# EAGLE design ledboard (EAGLE 6.5.0)
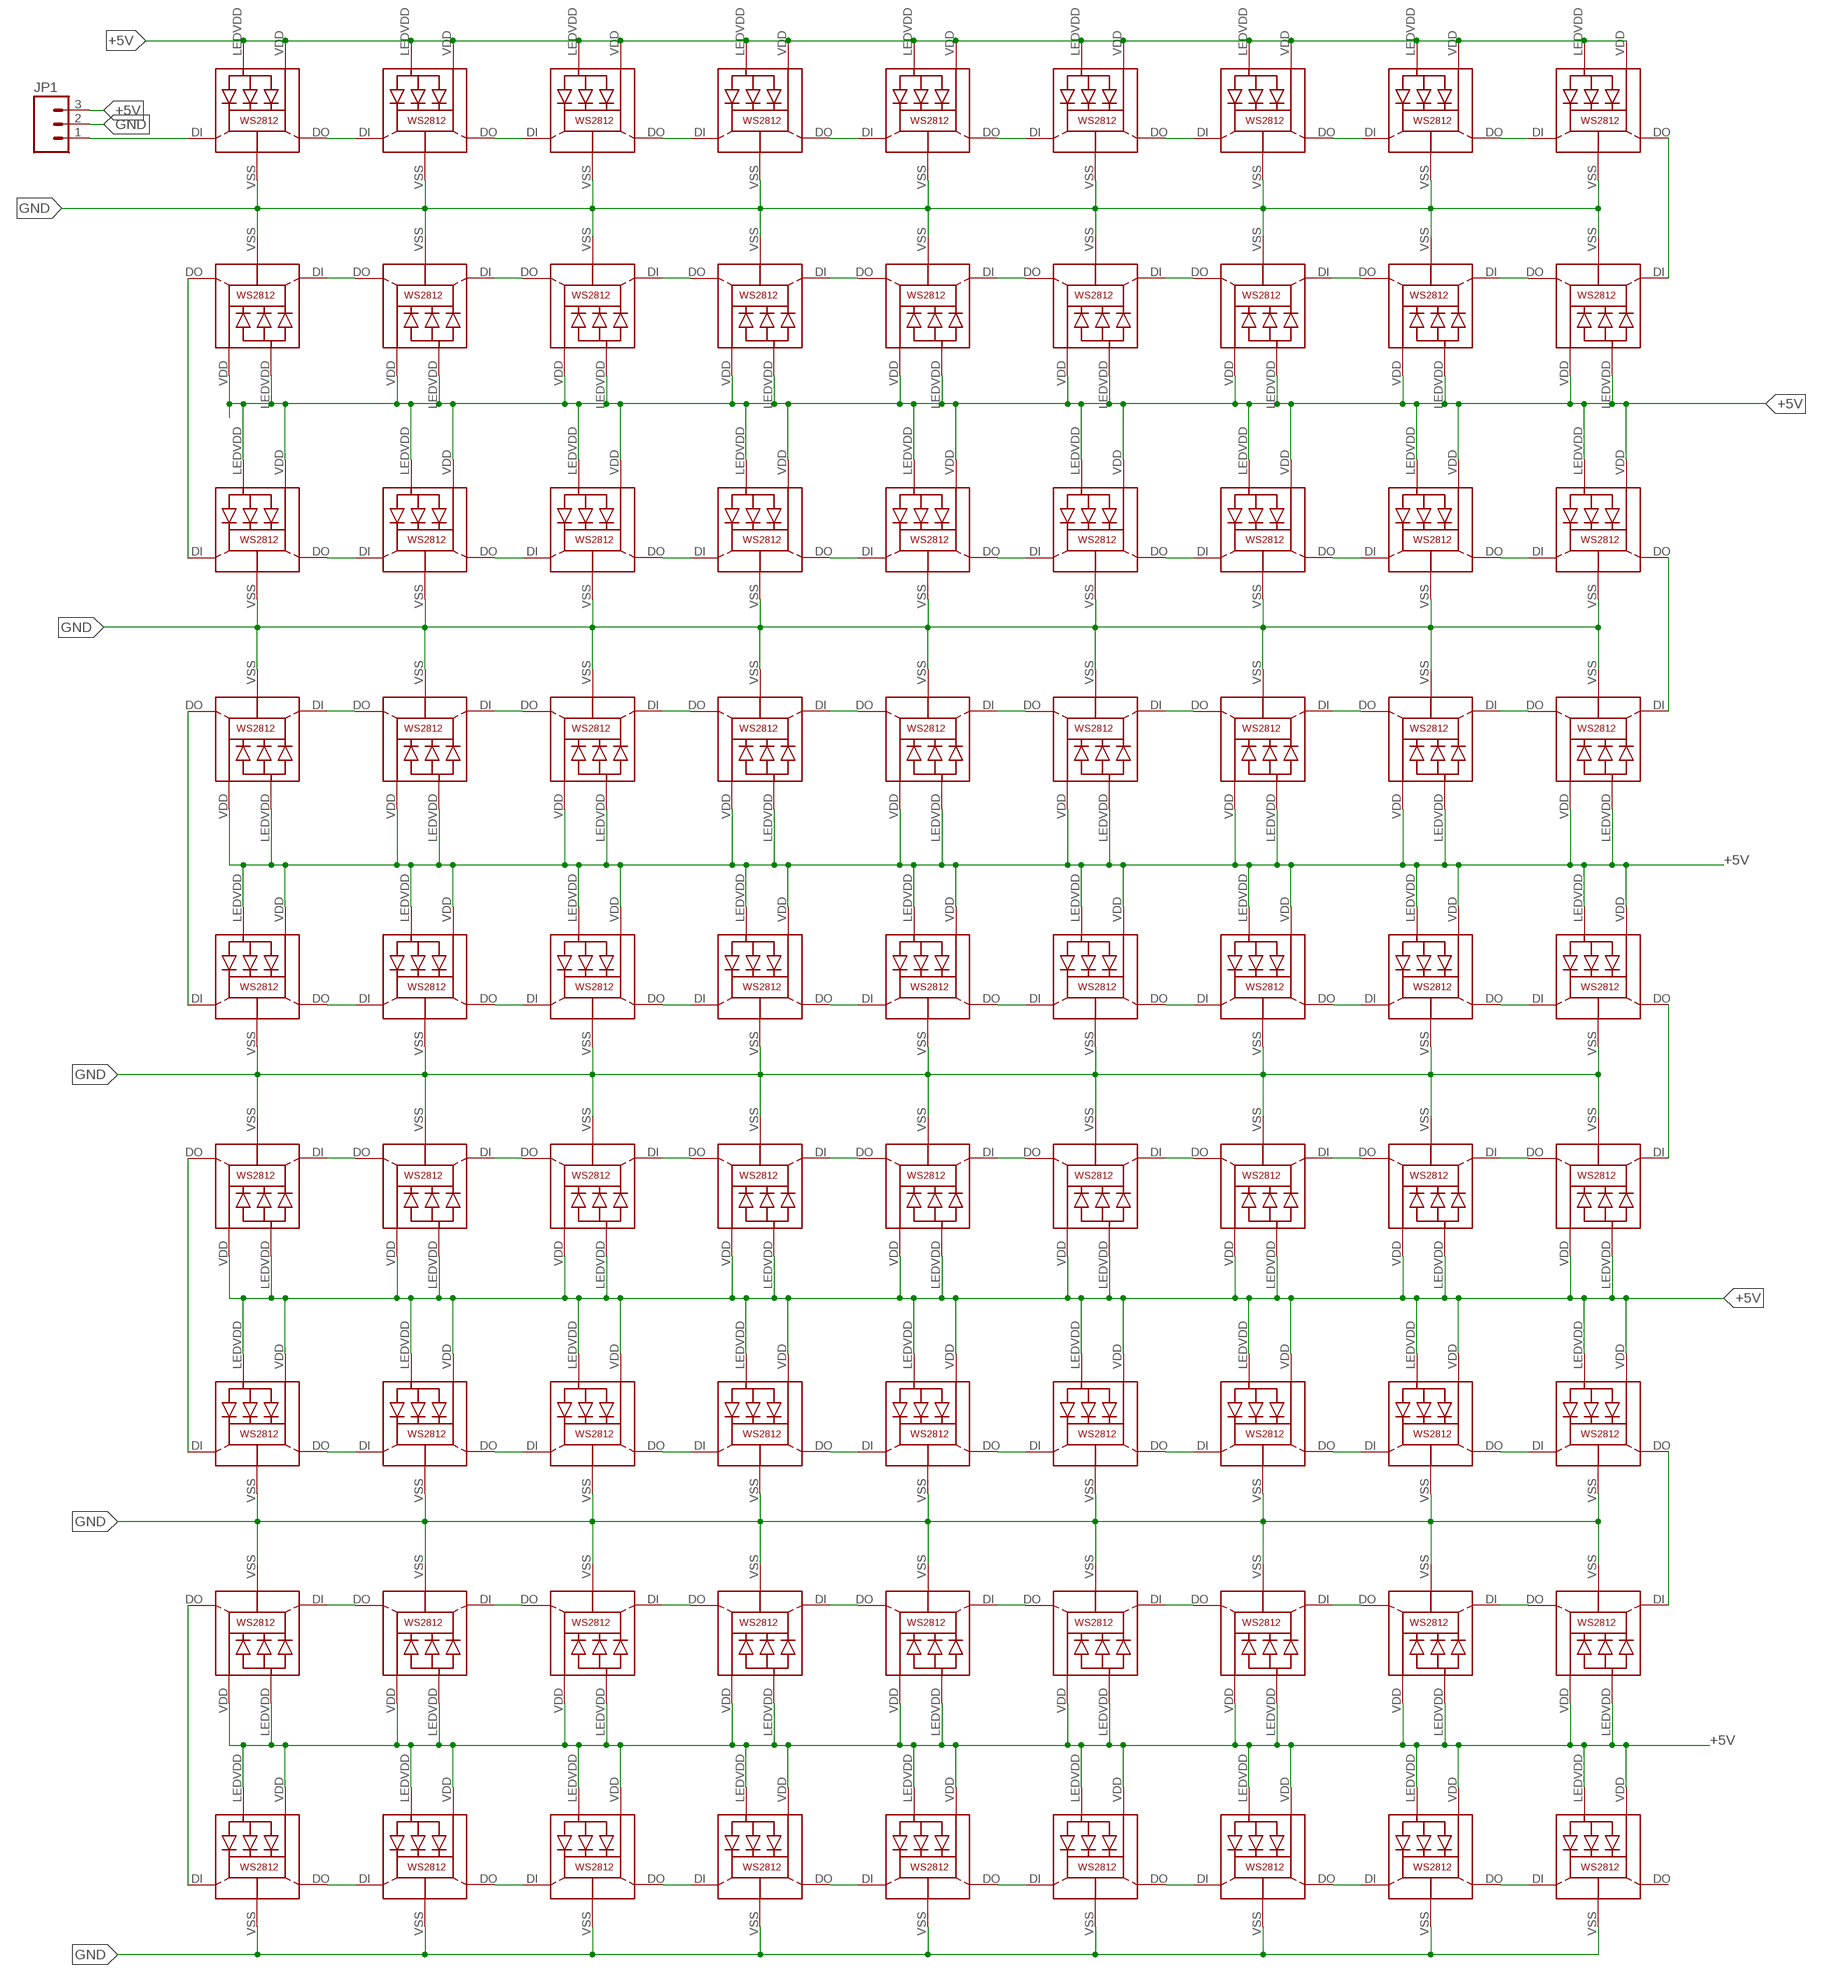
[diagram p0: schematic, sheet 1]

## Parts
JP1  M03LONGPADS  [1X03_LONGPADS]
LEDG00  WS2812  [WS2812]
LEDG01  WS2812  [WS2812]
LEDG02  WS2812  [WS2812]
LEDG03  WS2812  [WS2812]
LEDG04  WS2812  [WS2812]
LEDG05  WS2812  [WS2812]
LEDG06  WS2812  [WS2812]
LEDG07  WS2812  [WS2812]
LEDG08  WS2812  [WS2812]
LEDG10  WS2812  [WS2812]
LEDG11  WS2812  [WS2812]
LEDG12  WS2812  [WS2812]
LEDG13  WS2812  [WS2812]
LEDG14  WS2812  [WS2812]
LEDG15  WS2812  [WS2812]
LEDG16  WS2812  [WS2812]
LEDG17  WS2812  [WS2812]
LEDG18  WS2812  [WS2812]
LEDG20  WS2812  [WS2812]
LEDG21  WS2812  [WS2812]
LEDG22  WS2812  [WS2812]
LEDG23  WS2812  [WS2812]
LEDG24  WS2812  [WS2812]
LEDG25  WS2812  [WS2812]
LEDG26  WS2812  [WS2812]
LEDG27  WS2812  [WS2812]
LEDG28  WS2812  [WS2812]
LEDG30  WS2812  [WS2812]
LEDG31  WS2812  [WS2812]
LEDG32  WS2812  [WS2812]
LEDG33  WS2812  [WS2812]
LEDG34  WS2812  [WS2812]
LEDG35  WS2812  [WS2812]
LEDG36  WS2812  [WS2812]
LEDG37  WS2812  [WS2812]
LEDG38  WS2812  [WS2812]
LEDG40  WS2812  [WS2812]
LEDG41  WS2812  [WS2812]
LEDG42  WS2812  [WS2812]
LEDG43  WS2812  [WS2812]
LEDG44  WS2812  [WS2812]
LEDG45  WS2812  [WS2812]
LEDG46  WS2812  [WS2812]
LEDG47  WS2812  [WS2812]
LEDG48  WS2812  [WS2812]
LEDG50  WS2812  [WS2812]
LEDG51  WS2812  [WS2812]
LEDG52  WS2812  [WS2812]
LEDG53  WS2812  [WS2812]
LEDG54  WS2812  [WS2812]
LEDG55  WS2812  [WS2812]
LEDG56  WS2812  [WS2812]
LEDG57  WS2812  [WS2812]
LEDG58  WS2812  [WS2812]
LEDG60  WS2812  [WS2812]
LEDG61  WS2812  [WS2812]
LEDG62  WS2812  [WS2812]
LEDG63  WS2812  [WS2812]
LEDG64  WS2812  [WS2812]
LEDG65  WS2812  [WS2812]
LEDG66  WS2812  [WS2812]
LEDG67  WS2812  [WS2812]
LEDG68  WS2812  [WS2812]
LEDG70  WS2812  [WS2812]
LEDG71  WS2812  [WS2812]
LEDG72  WS2812  [WS2812]
LEDG73  WS2812  [WS2812]
LEDG74  WS2812  [WS2812]
LEDG75  WS2812  [WS2812]
LEDG76  WS2812  [WS2812]
LEDG77  WS2812  [WS2812]
LEDG78  WS2812  [WS2812]
LEDG80  WS2812  [WS2812]
LEDG81  WS2812  [WS2812]
LEDG82  WS2812  [WS2812]
LEDG83  WS2812  [WS2812]
LEDG84  WS2812  [WS2812]
LEDG85  WS2812  [WS2812]
LEDG86  WS2812  [WS2812]
LEDG87  WS2812  [WS2812]
LEDG88  WS2812  [WS2812]

## Nets
+5V: JP1.3 LEDG00.LEDVDD LEDG00.VDD LEDG01.LEDVDD LEDG01.VDD LEDG02.LEDVDD LEDG02.VDD LEDG03.LEDVDD LEDG03.VDD LEDG04.LEDVDD LEDG04.VDD LEDG05.LEDVDD LEDG05.VDD LEDG06.LEDVDD LEDG06.VDD LEDG07.LEDVDD LEDG07.VDD LEDG08.LEDVDD LEDG08.VDD LEDG10.LEDVDD LEDG10.VDD LEDG11.LEDVDD LEDG11.VDD LEDG12.LEDVDD LEDG12.VDD LEDG13.LEDVDD LEDG13.VDD LEDG14.LEDVDD LEDG14.VDD LEDG15.LEDVDD LEDG15.VDD LEDG16.LEDVDD LEDG16.VDD LEDG17.LEDVDD LEDG17.VDD LEDG18.LEDVDD LEDG18.VDD LEDG20.LEDVDD LEDG20.VDD LEDG21.LEDVDD LEDG21.VDD LEDG22.LEDVDD LEDG22.VDD LEDG23.LEDVDD LEDG23.VDD LEDG24.LEDVDD LEDG24.VDD LEDG25.LEDVDD LEDG25.VDD LEDG26.LEDVDD LEDG26.VDD LEDG27.LEDVDD LEDG27.VDD LEDG28.LEDVDD LEDG28.VDD LEDG30.LEDVDD LEDG30.VDD LEDG31.LEDVDD LEDG31.VDD LEDG32.LEDVDD LEDG32.VDD LEDG33.LEDVDD LEDG33.VDD LEDG34.LEDVDD LEDG34.VDD LEDG35.LEDVDD LEDG35.VDD LEDG36.LEDVDD LEDG36.VDD LEDG37.LEDVDD LEDG37.VDD LEDG38.LEDVDD LEDG38.VDD LEDG40.LEDVDD LEDG40.VDD LEDG41.LEDVDD LEDG41.VDD LEDG42.LEDVDD LEDG42.VDD LEDG43.LEDVDD LEDG43.VDD LEDG44.LEDVDD LEDG44.VDD LEDG45.LEDVDD LEDG45.VDD LEDG46.LEDVDD LEDG46.VDD LEDG47.LEDVDD LEDG47.VDD LEDG48.LEDVDD LEDG48.VDD LEDG50.LEDVDD LEDG50.VDD LEDG51.LEDVDD LEDG51.VDD LEDG52.LEDVDD LEDG52.VDD LEDG53.LEDVDD LEDG53.VDD LEDG54.LEDVDD LEDG54.VDD LEDG55.LEDVDD LEDG55.VDD LEDG56.LEDVDD LEDG56.VDD LEDG57.LEDVDD LEDG57.VDD LEDG58.LEDVDD LEDG58.VDD LEDG60.LEDVDD LEDG60.VDD LEDG61.LEDVDD LEDG61.VDD LEDG62.LEDVDD LEDG62.VDD LEDG63.LEDVDD LEDG63.VDD LEDG64.LEDVDD LEDG64.VDD LEDG65.LEDVDD LEDG65.VDD LEDG66.LEDVDD LEDG66.VDD LEDG67.LEDVDD LEDG67.VDD LEDG68.LEDVDD LEDG68.VDD LEDG70.LEDVDD LEDG70.VDD LEDG71.LEDVDD LEDG71.VDD LEDG72.LEDVDD LEDG72.VDD LEDG73.LEDVDD LEDG73.VDD LEDG74.LEDVDD LEDG74.VDD LEDG75.LEDVDD LEDG75.VDD LEDG76.LEDVDD LEDG76.VDD LEDG77.LEDVDD LEDG77.VDD LEDG78.LEDVDD LEDG78.VDD LEDG80.LEDVDD LEDG80.VDD LEDG81.LEDVDD LEDG81.VDD LEDG82.LEDVDD LEDG82.VDD LEDG83.LEDVDD LEDG83.VDD LEDG84.LEDVDD LEDG84.VDD LEDG85.LEDVDD LEDG85.VDD LEDG86.LEDVDD LEDG86.VDD LEDG87.LEDVDD LEDG87.VDD LEDG88.LEDVDD LEDG88.VDD
DIN: JP1.1 LEDG00.DI
GND: JP1.2 LEDG00.VSS(GND) LEDG01.VSS(GND) LEDG02.VSS(GND) LEDG03.VSS(GND) LEDG04.VSS(GND) LEDG05.VSS(GND) LEDG06.VSS(GND) LEDG07.VSS(GND) LEDG08.VSS(GND) LEDG10.VSS(GND) LEDG11.VSS(GND) LEDG12.VSS(GND) LEDG13.VSS(GND) LEDG14.VSS(GND) LEDG15.VSS(GND) LEDG16.VSS(GND) LEDG17.VSS(GND) LEDG18.VSS(GND) LEDG20.VSS(GND) LEDG21.VSS(GND) LEDG22.VSS(GND) LEDG23.VSS(GND) LEDG24.VSS(GND) LEDG25.VSS(GND) LEDG26.VSS(GND) LEDG27.VSS(GND) LEDG28.VSS(GND) LEDG30.VSS(GND) LEDG31.VSS(GND) LEDG32.VSS(GND) LEDG33.VSS(GND) LEDG34.VSS(GND) LEDG35.VSS(GND) LEDG36.VSS(GND) LEDG37.VSS(GND) LEDG38.VSS(GND) LEDG40.VSS(GND) LEDG41.VSS(GND) LEDG42.VSS(GND) LEDG43.VSS(GND) LEDG44.VSS(GND) LEDG45.VSS(GND) LEDG46.VSS(GND) LEDG47.VSS(GND) LEDG48.VSS(GND) LEDG50.VSS(GND) LEDG51.VSS(GND) LEDG52.VSS(GND) LEDG53.VSS(GND) LEDG54.VSS(GND) LEDG55.VSS(GND) LEDG56.VSS(GND) LEDG57.VSS(GND) LEDG58.VSS(GND) LEDG60.VSS(GND) LEDG61.VSS(GND) LEDG62.VSS(GND) LEDG63.VSS(GND) LEDG64.VSS(GND) LEDG65.VSS(GND) LEDG66.VSS(GND) LEDG67.VSS(GND) LEDG68.VSS(GND) LEDG70.VSS(GND) LEDG71.VSS(GND) LEDG72.VSS(GND) LEDG73.VSS(GND) LEDG74.VSS(GND) LEDG75.VSS(GND) LEDG76.VSS(GND) LEDG77.VSS(GND) LEDG78.VSS(GND) LEDG80.VSS(GND) LEDG81.VSS(GND) LEDG82.VSS(GND) LEDG83.VSS(GND) LEDG84.VSS(GND) LEDG85.VSS(GND) LEDG86.VSS(GND) LEDG87.VSS(GND) LEDG88.VSS(GND)
N$2: LEDG00.DO LEDG10.DI
N$3: LEDG10.DO LEDG20.DI
N$4: LEDG20.DO LEDG30.DI
N$5: LEDG30.DO LEDG40.DI
N$6: LEDG40.DO LEDG50.DI
N$7: LEDG50.DO LEDG60.DI
N$8: LEDG60.DO LEDG70.DI
N$9: LEDG70.DO LEDG80.DI
N$10: LEDG80.DO LEDG81.DI
N$11: LEDG71.DI LEDG81.DO
N$12: LEDG61.DI LEDG71.DO
N$13: LEDG51.DI LEDG61.DO
N$14: LEDG41.DI LEDG51.DO
N$15: LEDG31.DI LEDG41.DO
N$16: LEDG21.DI LEDG31.DO
N$17: LEDG11.DI LEDG21.DO
N$18: LEDG01.DI LEDG11.DO
N$19: LEDG01.DO LEDG02.DI
N$20: LEDG02.DO LEDG12.DI
N$21: LEDG12.DO LEDG22.DI
N$22: LEDG22.DO LEDG32.DI
N$23: LEDG32.DO LEDG42.DI
N$24: LEDG42.DO LEDG52.DI
N$25: LEDG52.DO LEDG62.DI
N$26: LEDG62.DO LEDG72.DI
N$27: LEDG72.DO LEDG82.DI
N$28: LEDG82.DO LEDG83.DI
N$29: LEDG73.DI LEDG83.DO
N$30: LEDG63.DI LEDG73.DO
N$31: LEDG53.DI LEDG63.DO
N$32: LEDG43.DI LEDG53.DO
N$33: LEDG33.DI LEDG43.DO
N$34: LEDG23.DI LEDG33.DO
N$35: LEDG13.DI LEDG23.DO
N$36: LEDG03.DI LEDG13.DO
N$37: LEDG03.DO LEDG04.DI
N$38: LEDG04.DO LEDG14.DI
N$39: LEDG14.DO LEDG24.DI
N$40: LEDG24.DO LEDG34.DI
N$41: LEDG34.DO LEDG44.DI
N$42: LEDG44.DO LEDG54.DI
N$43: LEDG54.DO LEDG64.DI
N$44: LEDG64.DO LEDG74.DI
N$45: LEDG74.DO LEDG84.DI
N$46: LEDG84.DO LEDG85.DI
N$47: LEDG75.DI LEDG85.DO
N$48: LEDG65.DI LEDG75.DO
N$49: LEDG55.DI LEDG65.DO
N$50: LEDG45.DI LEDG55.DO
N$51: LEDG35.DI LEDG45.DO
N$52: LEDG25.DI LEDG35.DO
N$53: LEDG15.DI LEDG25.DO
N$54: LEDG05.DI LEDG15.DO
N$55: LEDG05.DO LEDG06.DI
N$56: LEDG06.DO LEDG16.DI
N$57: LEDG16.DO LEDG26.DI
N$58: LEDG26.DO LEDG36.DI
N$59: LEDG36.DO LEDG46.DI
N$60: LEDG46.DO LEDG56.DI
N$61: LEDG56.DO LEDG66.DI
N$62: LEDG66.DO LEDG76.DI
N$63: LEDG76.DO LEDG86.DI
N$64: LEDG86.DO LEDG87.DI
N$65: LEDG77.DI LEDG87.DO
N$66: LEDG67.DI LEDG77.DO
N$67: LEDG57.DI LEDG67.DO
N$68: LEDG47.DI LEDG57.DO
N$69: LEDG37.DI LEDG47.DO
N$70: LEDG27.DI LEDG37.DO
N$71: LEDG17.DI LEDG27.DO
N$72: LEDG07.DI LEDG17.DO
N$73: LEDG07.DO LEDG08.DI
N$74: LEDG08.DO LEDG18.DI
N$75: LEDG18.DO LEDG28.DI
N$76: LEDG28.DO LEDG38.DI
N$77: LEDG38.DO LEDG48.DI
N$78: LEDG48.DO LEDG58.DI
N$79: LEDG58.DO LEDG68.DI
N$80: LEDG68.DO LEDG78.DI
N$81: LEDG78.DO LEDG88.DI
Unconnected: LEDG88.DO

## Library data of the parts
JP1 = SparkFun-Connectors:M03: Header 3 Standard 3-pin 0.1" header. Use with straight break away headers (SKU : PRT-00116), right angle break away headers (PRT-00553), swiss pins (PRT-00743), machine pins (PRT-00117), and female headers (PRT-00115). Molex polarized connector foot print use with SKU : PRT-08232 with associated crimp pins and housings.
LEDG00 LEDG01-LEDG08 LEDG10-LEDG18 LEDG20-LEDG28 LEDG30-LEDG38 LEDG40-LEDG48 LEDG50-LEDG58 LEDG60-LEDG68 LEDG70-LEDG78 LEDG80-LEDG88 = adafruit:WS2812

## Board
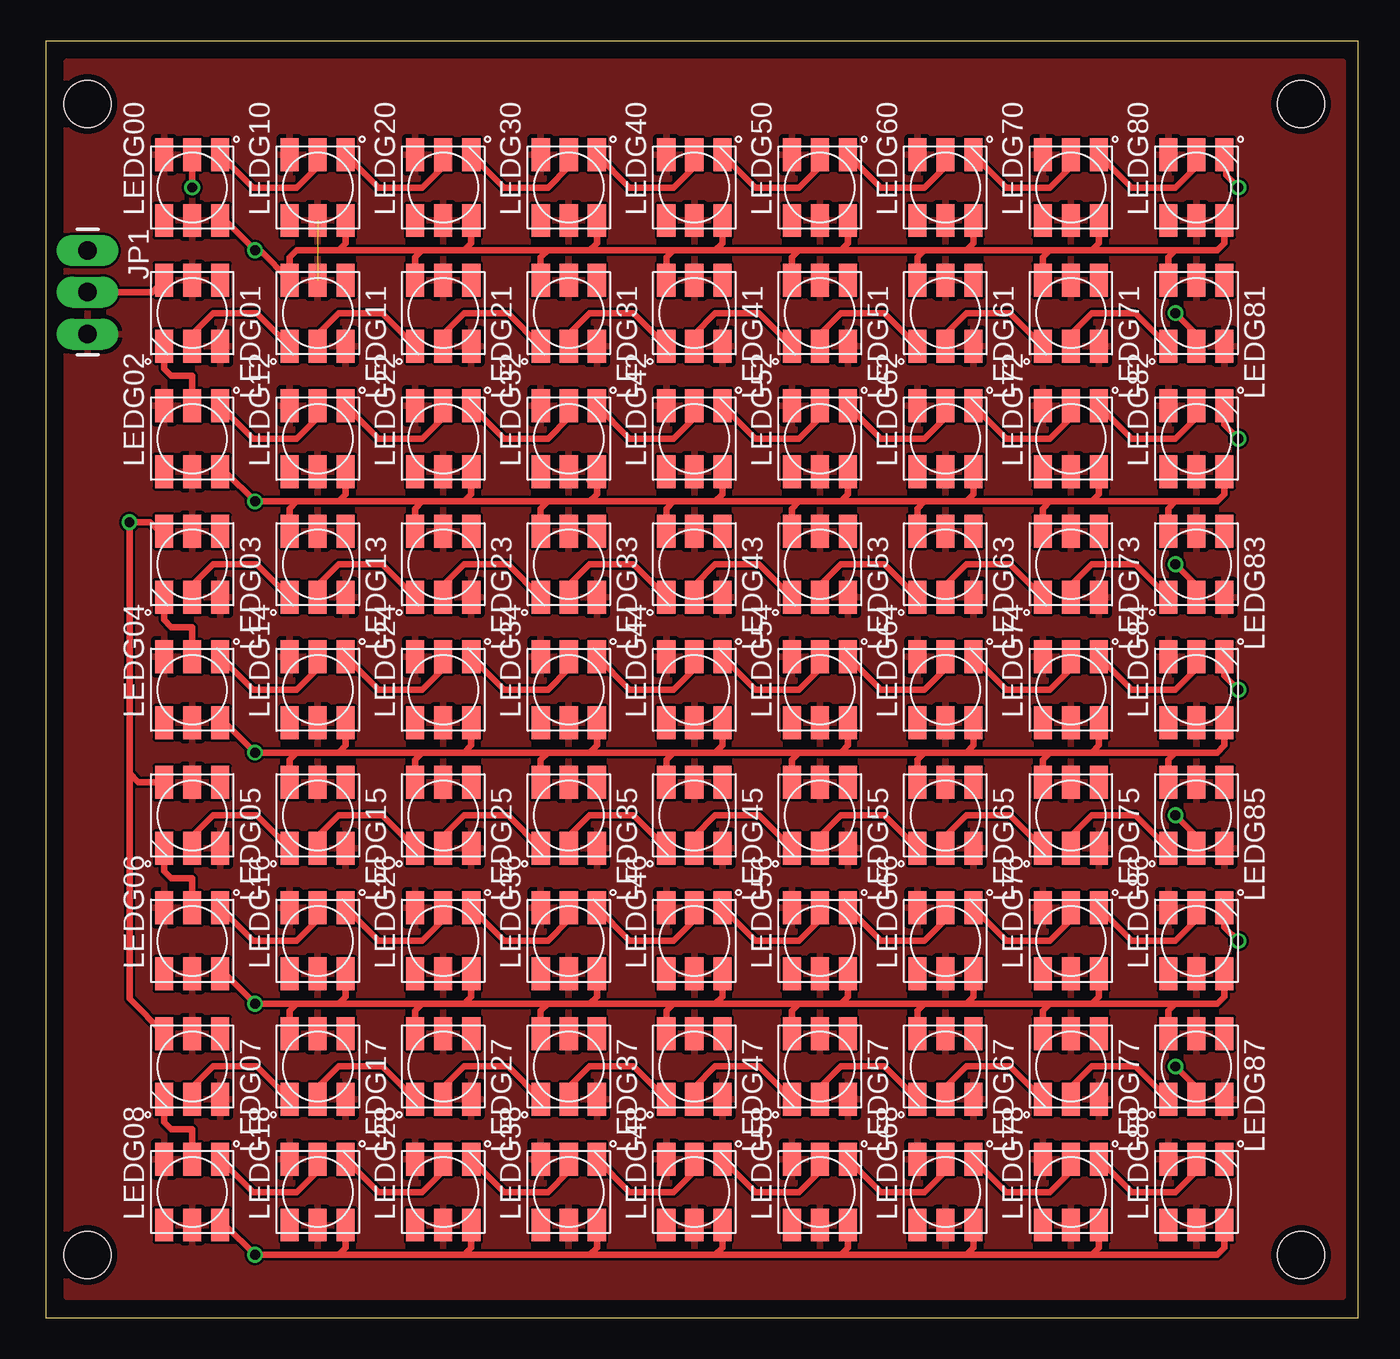
[diagram p1: board, top side]
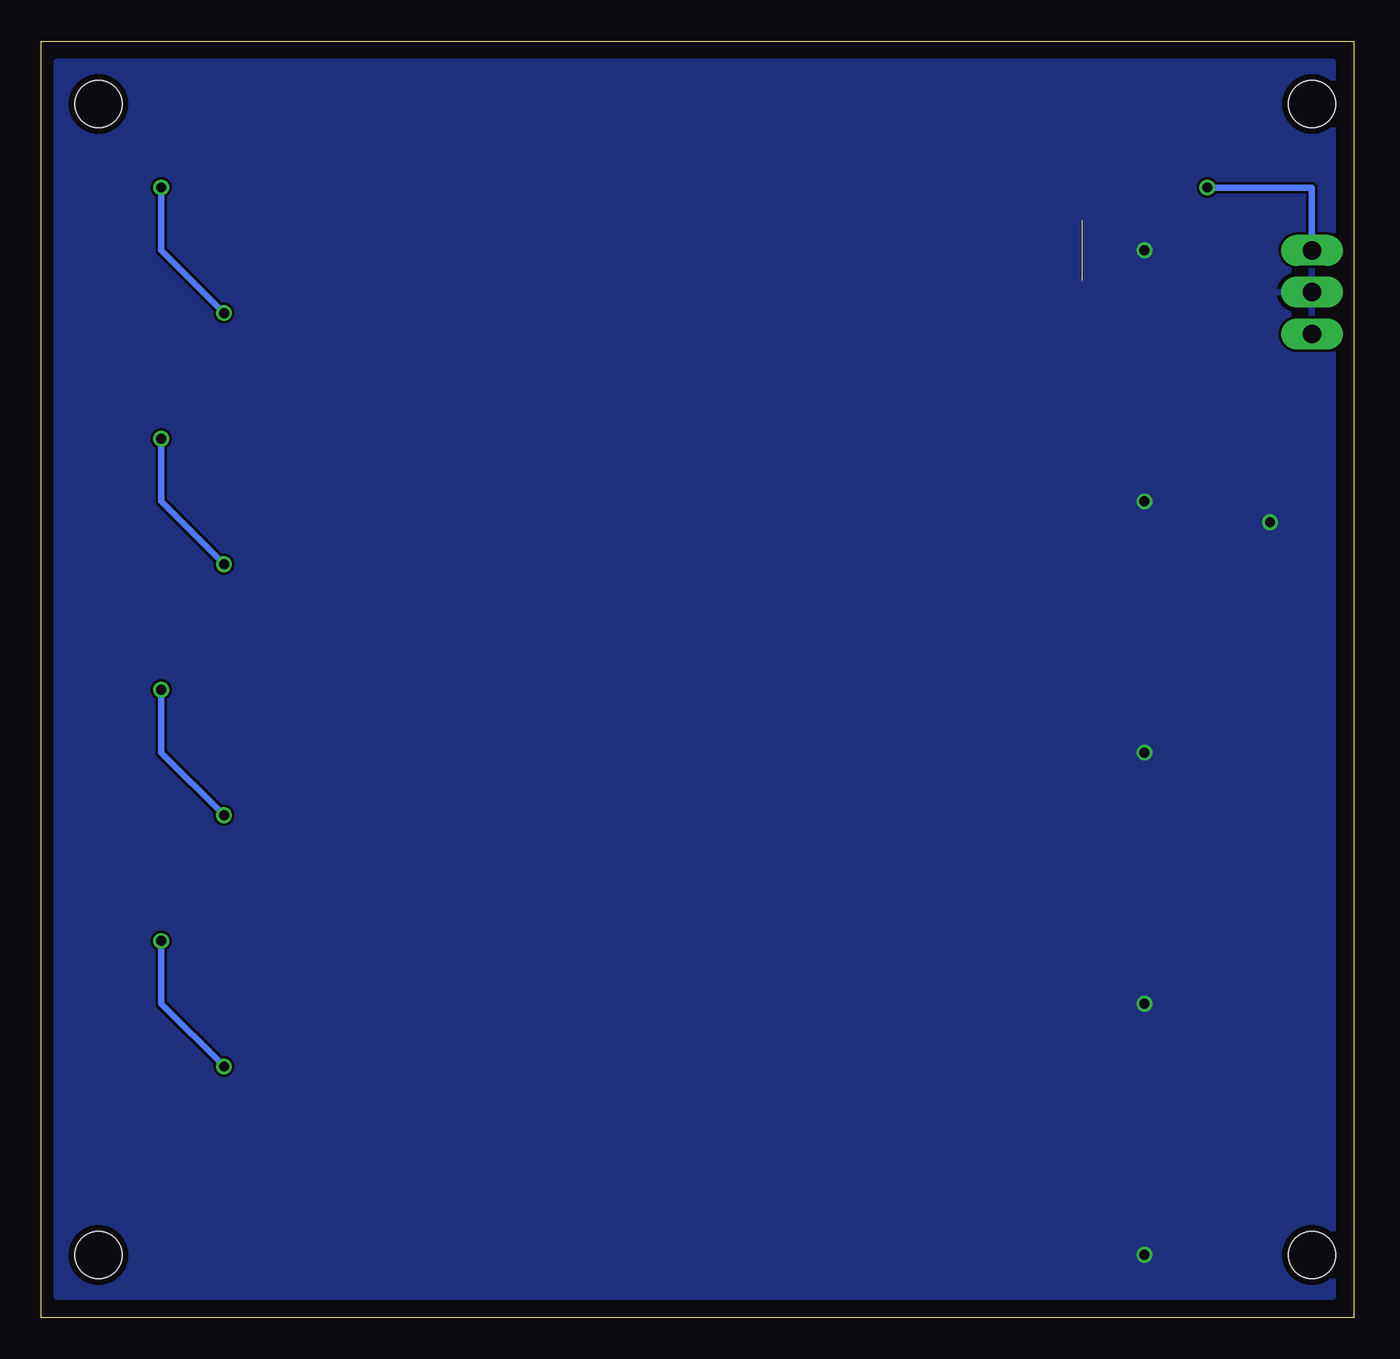
[diagram p2: board, bottom side, seen from below]

Size 79.68 x 77.46 mm. Coordinates in mm from the lower left corner, seen from the top.
Outline: 0,0 79.68,0 79.68,77.46 0,77.46 0,0
Copper layers (1*16): Top 0.0356mm / dielectric 1.5011mm / Bottom 0.0356mm
Design rules "LaenPCBOrder": minimum track width 6mil, minimum drill 13mil, track to track 6mil, track to pad 6mil, pad to pad 6mil, via to via 6mil, smd to smd 6mil, copper to edge 15mil, drill to drill 6mil, minimum pad ring 7mil, minimum via ring 7mil, stop-mask expansion 3mil, vias tented up to drill 0mil, thermal gap 10mil
Holes 2.84 mm at 2.54,73.66 76.2,73.66 76.2,3.81 2.54,3.81

### Footprints (pad centres in the part's own frame; a part is rotated, then mirrored left to right if it is on the bottom)
1X03_LONGPADS = drill 1.118 pad 1.88 long: 1 0,0; 2 2.54,0; 3 5.08,0
WS2812 = smd 2 x 1.1: DI 2,0; DO 2,-1.7; LEDVDD -2,0; NC -2,1.7; VDD 2,1.7; VSS -2,-1.7

### Placement (x,y rotation side)
JP1  2.54,64.77 270 top
LEDG00  8.89,68.58 90 top
LEDG01  8.89,60.96 270 top
LEDG02  8.89,53.34 90 top
LEDG03  8.89,45.72 270 top
LEDG04  8.89,38.1 90 top
LEDG05  8.89,30.48 270 top
LEDG06  8.89,22.86 90 top
LEDG07  8.89,15.24 270 top
LEDG08  8.89,7.62 90 top
LEDG10  16.51,68.58 90 top
LEDG11  16.51,60.96 270 top
LEDG12  16.51,53.34 90 top
LEDG13  16.51,45.72 270 top
LEDG14  16.51,38.1 90 top
LEDG15  16.51,30.48 270 top
LEDG16  16.51,22.86 90 top
LEDG17  16.51,15.24 270 top
LEDG18  16.51,7.62 90 top
LEDG20  24.13,68.58 90 top
LEDG21  24.13,60.96 270 top
LEDG22  24.13,53.34 90 top
LEDG23  24.13,45.72 270 top
LEDG24  24.13,38.1 90 top
LEDG25  24.13,30.48 270 top
LEDG26  24.13,22.86 90 top
LEDG27  24.13,15.24 270 top
LEDG28  24.13,7.62 90 top
LEDG30  31.75,68.58 90 top
LEDG31  31.75,60.96 270 top
LEDG32  31.75,53.34 90 top
LEDG33  31.75,45.72 270 top
LEDG34  31.75,38.1 90 top
LEDG35  31.75,30.48 270 top
LEDG36  31.75,22.86 90 top
LEDG37  31.75,15.24 270 top
LEDG38  31.75,7.62 90 top
LEDG40  39.37,68.58 90 top
LEDG41  39.37,60.96 270 top
LEDG42  39.37,53.34 90 top
LEDG43  39.37,45.72 270 top
LEDG44  39.37,38.1 90 top
LEDG45  39.37,30.48 270 top
LEDG46  39.37,22.86 90 top
LEDG47  39.37,15.24 270 top
LEDG48  39.37,7.62 90 top
LEDG50  46.99,68.58 90 top
LEDG51  46.99,60.96 270 top
LEDG52  46.99,53.34 90 top
LEDG53  46.99,45.72 270 top
LEDG54  46.99,38.1 90 top
LEDG55  46.99,30.48 270 top
LEDG56  46.99,22.86 90 top
LEDG57  46.99,15.24 270 top
LEDG58  46.99,7.62 90 top
LEDG60  54.61,68.58 90 top
LEDG61  54.61,60.96 270 top
LEDG62  54.61,53.34 90 top
LEDG63  54.61,45.72 270 top
LEDG64  54.61,38.1 90 top
LEDG65  54.61,30.48 270 top
LEDG66  54.61,22.86 90 top
LEDG67  54.61,15.24 270 top
LEDG68  54.61,7.62 90 top
LEDG70  62.23,68.58 90 top
LEDG71  62.23,60.96 270 top
LEDG72  62.23,53.34 90 top
LEDG73  62.23,45.72 270 top
LEDG74  62.23,38.1 90 top
LEDG75  62.23,30.48 270 top
LEDG76  62.23,22.86 90 top
LEDG77  62.23,15.24 270 top
LEDG78  62.23,7.62 90 top
LEDG80  69.85,68.58 90 top
LEDG81  69.85,60.96 270 top
LEDG82  69.85,53.34 90 top
LEDG83  69.85,45.72 270 top
LEDG84  69.85,38.1 90 top
LEDG85  69.85,30.48 270 top
LEDG86  69.85,22.86 90 top
LEDG87  69.85,15.24 270 top
LEDG88  69.85,7.62 90 top

### Tracks (layer width: path | path; a pad name or v marks a point on that pad's centre or on a via)
+5V  (1 unrouted)
  pour Top: 1.27,76.2 1.27,1.27 78.74,1.27 78.74,76.2
DIN  (via drill 0.6)
  Top 0.406: LEDG00.DI v8.89,68.58
  Bottom 0.406: JP1.1 2.54,68.58 v8.89,68.58
GND  (via drill 0.6)
  Top 0.406: LEDG00.VSS 10.89,66.58 v12.7,64.77 13,64.77 LEDG11.VSS 14.81,64.34 15.24,64.77 17.78,64.77 | 17.78,64.77 22.86,64.77 | 22.86,64.77 25.4,64.77 | 25.4,64.77 30.48,64.77 | 30.48,64.77 33.02,64.77 | 33.02,64.77 38.1,64.77 | 38.1,64.77 40.64,64.77 | 40.64,64.77 45.72,64.77 | 45.72,64.77 48.26,64.77 | 48.26,64.77 53.34,64.77 | 53.34,64.77 55.88,64.77 | 55.88,64.77 60.96,64.77 | 60.96,64.77 63.5,64.77 | 63.5,64.77 68.58,64.77 | 68.58,64.77 71.12,64.77 71.55,65.2 LEDG80.VSS | LEDG10.VSS 18.21,65.2 17.78,64.77 | LEDG21.VSS 22.43,64.34 22.86,64.77 | LEDG20.VSS 25.83,65.2 25.4,64.77 | LEDG31.VSS 30.05,64.34 30.48,64.77 | LEDG30.VSS 33.45,65.2 33.02,64.77 | LEDG41.VSS 37.67,64.34 38.1,64.77 | LEDG40.VSS 41.07,65.2 40.64,64.77 | LEDG51.VSS 45.29,64.34 45.72,64.77 | LEDG50.VSS 48.69,65.2 48.26,64.77 | LEDG61.VSS 52.91,64.34 53.34,64.77 | LEDG60.VSS 56.31,65.2 55.88,64.77 | LEDG71.VSS 60.53,64.34 60.96,64.77 | LEDG70.VSS 63.93,65.2 63.5,64.77 | LEDG81.VSS 68.15,64.34 68.58,64.77 | JP1.2 6.46,62.23 LEDG01.VSS | LEDG02.VSS 10.89,51.34 v12.7,49.53 15.24,49.53 | 15.24,49.53 17.78,49.53 | 17.78,49.53 22.86,49.53 | 22.86,49.53 25.4,49.53 | 25.4,49.53 30.48,49.53 | 30.48,49.53 33.02,49.53 | 33.02,49.53 38.1,49.53 | 38.1,49.53 40.64,49.53 | 40.64,49.53 45.72,49.53 | 45.72,49.53 48.26,49.53 | 48.26,49.53 53.34,49.53 | 53.34,49.53 55.88,49.53 | 55.88,49.53 60.96,49.53 | 60.96,49.53 63.5,49.53 | 63.5,49.53 68.58,49.53 | 68.58,49.53 71.12,49.53 71.55,49.96 LEDG82.VSS | LEDG13.VSS 14.81,49.1 15.24,49.53 | LEDG12.VSS 18.21,49.96 17.78,49.53 | LEDG23.VSS 22.43,49.1 22.86,49.53 | LEDG22.VSS 25.83,49.96 25.4,49.53 | LEDG33.VSS 30.05,49.1 30.48,49.53 | LEDG32.VSS 33.45,51.23
  Top 0.406: 33.45,51.23 33.02,50.8 | 33.45,51.23 33.45,49.96 33.02,49.53 | LEDG43.VSS 37.67,49.1 38.1,49.53 | LEDG42.VSS 41.07,49.96 40.64,49.53 | LEDG53.VSS 45.29,49.1 45.72,49.53 | LEDG52.VSS 48.69,49.96 48.26,49.53 | LEDG63.VSS 52.91,49.1 53.34,49.53 | LEDG62.VSS 56.31,49.96 55.88,49.53 | LEDG73.VSS 60.53,49.1 60.96,49.53 | LEDG72.VSS 63.93,49.96 63.5,49.53 | LEDG83.VSS 68.15,49.1 68.58,49.53 | 5.08,33.02 v5.08,48.26 6.35,48.26 6.89,47.72 LEDG03.VSS | 5.08,33.02 5.08,19.35 LEDG07.VSS | LEDG05.VSS 5.62,32.48 5.08,33.02 | LEDG04.VSS 10.89,36.1 v12.7,34.29 15.24,34.29 | 14.51,32.48 LEDG15.VSS 14.81,33.86 15.24,34.29 | LEDG84.VSS 71.55,34.72 71.12,34.29 68.58,34.29 | 68.58,34.29 63.5,34.29 | 63.5,34.29 60.96,34.29 | 60.96,34.29 55.88,34.29 | 55.88,34.29 53.34,34.29 | 53.34,34.29 48.26,34.29 | 48.26,34.29 45.72,34.29 | 45.72,34.29 40.64,34.29 | 40.64,34.29 38.1,34.29 | 38.1,34.29 33.02,34.29 | 33.02,34.29 30.48,34.29 | 30.48,34.29 25.4,34.29 | 25.4,34.29 22.86,34.29 | 22.86,34.29 17.78,34.29 | 17.78,34.29 15.24,34.29 | LEDG14.VSS 18.21,34.72 17.78,34.29 | LEDG25.VSS 22.43,33.86 22.86,34.29 | LEDG24.VSS 25.83,34.72 25.4,34.29 | LEDG35.VSS 30.05,33.86 30.48,34.29 | LEDG34.VSS 33.45,34.72 33.02,34.29 | LEDG45.VSS 37.67,33.86 38.1,34.29 | LEDG44.VSS 41.07,34.72 40.64,34.29 | LEDG55.VSS 45.29,33.86 45.72,34.29 | LEDG54.VSS 48.69,34.72 48.26,34.29 | LEDG65.VSS 52.91,33.86 53.34,34.29 | LEDG64.VSS 56.31,34.72 55.88,34.29 | LEDG75.VSS 60.53,33.86 60.96,34.29 | LEDG74.VSS 63.93,34.72 63.5,34.29 | LEDG85.VSS 68.15,33.86 68.58,34.29 | LEDG06.VSS 10.89,20.86 v12.7,19.05 15.24,19.05 | LEDG86.VSS 71.55,19.48 71.12,19.05 68.58,19.05 | 68.58,19.05 63.5,19.05
  Top 0.406: 63.5,19.05 60.96,19.05 | 60.96,19.05 55.88,19.05 | 55.88,19.05 53.34,19.05 | 53.34,19.05 48.26,19.05 | 48.26,19.05 45.72,19.05 | 45.72,19.05 40.64,19.05 | 40.64,19.05 38.1,19.05 | 38.1,19.05 33.02,19.05 | 33.02,19.05 30.48,19.05 | 30.48,19.05 25.4,19.05 | 25.4,19.05 22.86,19.05 | 22.86,19.05 17.78,19.05 | 17.78,19.05 15.24,19.05 | LEDG17.VSS 14.81,18.62 15.24,19.05 | LEDG16.VSS 18.21,19.48 17.78,19.05 | LEDG27.VSS 22.43,18.62 22.86,19.05 | LEDG26.VSS 25.83,19.48 25.4,19.05 | LEDG37.VSS 30.05,18.62 30.48,19.05 | LEDG36.VSS 33.45,19.48 33.02,19.05 | LEDG47.VSS 37.67,18.62 38.1,19.05 | LEDG46.VSS 41.07,19.48 40.64,19.05 | LEDG57.VSS 45.29,18.62 45.72,19.05 | LEDG56.VSS 48.69,19.48 48.26,19.05 | LEDG67.VSS 52.91,18.62 53.34,19.05 | LEDG66.VSS 56.31,19.48 55.88,19.05 | LEDG77.VSS 60.53,18.62 60.96,19.05 | LEDG76.VSS 63.93,19.48 63.5,19.05 | LEDG87.VSS 68.15,18.62 68.58,19.05 | LEDG08.VSS 10.89,5.62 v12.7,3.81 17.78,3.81 | LEDG88.VSS 71.55,4.24 71.12,3.81 63.5,3.81 | 63.5,3.81 55.88,3.81 | 55.88,3.81 48.26,3.81 | 48.26,3.81 40.64,3.81 | 40.64,3.81 33.02,3.81 | 33.02,3.81 25.4,3.81 | 25.4,3.81 17.78,3.81 | LEDG18.VSS 18.21,4.24 17.78,3.81 | LEDG28.VSS 25.83,4.24 25.4,3.81 | LEDG38.VSS 33.45,4.24 33.02,3.81 | LEDG48.VSS 41.07,4.24 40.64,3.81 | LEDG58.VSS 48.69,4.24 48.26,3.81 | LEDG68.VSS 56.31,4.24 55.88,3.81 | LEDG78.VSS 63.93,4.24 63.5,3.81
  pour Bottom: 1.27,76.2 1.27,1.27 78.74,1.27 78.74,76.2
N$2
  Top 0.406: LEDG10.DI 16.51,69.85 15.24,68.58 12.59,68.58 LEDG00.DO
N$3
  Top 0.406: LEDG20.DI 24.13,69.85 22.86,68.58 20.21,68.58 LEDG10.DO
N$4
  Top 0.406: 25.94,70.58 LEDG20.DO 27.83,68.58 30.48,68.58 31.75,69.85 LEDG30.DI
N$5
  Top 0.406: 33.56,70.58 LEDG30.DO 35.45,68.58 38.1,68.58 39.37,69.85 LEDG40.DI
N$6
  Top 0.406: 41.18,70.58 LEDG40.DO 43.07,68.58 45.72,68.58 46.99,69.85 LEDG50.DI
N$7
  Top 0.406: 48.8,70.58 LEDG50.DO 50.69,68.58 53.34,68.58 54.61,69.85 LEDG60.DI
N$8
  Top 0.406: 56.42,70.58 LEDG60.DO 58.31,68.58 60.96,68.58 62.23,69.85 LEDG70.DI
N$9
  Top 0.406: 64.04,70.58 LEDG70.DO 65.93,68.58 68.58,68.58 69.85,69.85 LEDG80.DI
N$10  (via drill 0.6)
  Top 0.406: LEDG80.DO 71.66,70.58 71.66,69.31 v72.39,68.58 | LEDG81.DI 69.85,59.69 v68.58,60.96
  Bottom 0.406: v72.39,68.58 72.39,64.77 v68.58,60.96
N$11
  Top 0.406: 68.04,58.96 LEDG81.DO 66.15,60.96 63.5,60.96 62.23,59.69 LEDG71.DI
N$12
  Top 0.406: 60.42,58.96 LEDG71.DO 58.53,60.96 55.88,60.96 54.61,59.69 LEDG61.DI
N$13
  Top 0.406: 52.8,58.96 LEDG61.DO 50.91,60.96 48.26,60.96 46.99,59.69 LEDG51.DI
N$14
  Top 0.406: 45.18,58.96 LEDG51.DO 43.29,60.96 40.64,60.96 39.37,59.69 LEDG41.DI
N$15
  Top 0.406: 37.56,58.96 LEDG41.DO 35.67,60.96 33.02,60.96 31.75,59.69 LEDG31.DI
N$16
  Top 0.406: 29.94,58.96 LEDG31.DO 28.05,60.96 25.4,60.96 24.13,59.69 LEDG21.DI
N$17
  Top 0.406: 22.32,58.96 LEDG21.DO 20.43,60.96 17.78,60.96 16.51,59.69 LEDG11.DI
N$18
  Top 0.406: 14.7,58.96 LEDG11.DO 12.81,60.96 10.16,60.96 8.89,59.69 LEDG01.DI
N$19
  Top 0.406: LEDG01.DO 7.19,57.58 7.62,57.15 8.89,57.15 LEDG02.DI
N$20
  Top 0.406: 10.7,55.34 LEDG02.DO 12.59,53.34 15.24,53.34 16.51,54.61 LEDG12.DI
N$21
  Top 0.406: 18.32,55.34 LEDG12.DO 20.21,53.34 22.86,53.34 24.13,54.61 LEDG22.DI
N$22
  Top 0.406: 25.94,55.34 LEDG22.DO 27.83,53.34 30.48,53.34 31.75,54.61 LEDG32.DI
N$23
  Top 0.406: 33.56,55.34 LEDG32.DO 35.45,53.34 38.1,53.34 39.37,54.61 LEDG42.DI
N$24
  Top 0.406: 41.18,55.34 LEDG42.DO 43.07,53.34 45.72,53.34 46.99,54.61 LEDG52.DI
N$25
  Top 0.406: 48.8,55.34 LEDG52.DO 50.69,53.34 53.34,53.34 54.61,54.61 LEDG62.DI
N$26
  Top 0.406: 56.42,55.34 LEDG62.DO 58.31,53.34 60.96,53.34 62.23,54.61 LEDG72.DI
N$27
  Top 0.406: 64.04,55.34 LEDG72.DO 65.93,53.34 68.58,53.34 69.85,54.61 LEDG82.DI
N$28  (via drill 0.6)
  Top 0.406: LEDG82.DO 71.55,54.18 v72.39,53.34 | v68.58,45.72 69.85,44.45 LEDG83.DI
  Bottom 0.406: v72.39,53.34 72.39,49.53 v68.58,45.72
N$29
  Top 0.406: LEDG73.DI 62.23,44.45 63.5,45.72 66.15,45.72 LEDG83.DO
N$30
  Top 0.406: LEDG63.DI 54.61,44.45 55.88,45.72 58.53,45.72 LEDG73.DO
N$31
  Top 0.406: LEDG53.DI 46.99,44.45 48.26,45.72 50.91,45.72 LEDG63.DO
N$32
  Top 0.406: LEDG43.DI 39.37,44.45 40.64,45.72 43.29,45.72 LEDG53.DO
N$33
  Top 0.406: LEDG33.DI 31.75,44.45 33.02,45.72 35.67,45.72 LEDG43.DO
N$34
  Top 0.406: LEDG23.DI 24.13,44.45 25.4,45.72 28.05,45.72 LEDG33.DO
N$35
  Top 0.406: LEDG13.DI 16.51,44.45 17.78,45.72 20.43,45.72 LEDG23.DO
N$36
  Top 0.406: LEDG03.DI 8.89,44.45 10.16,45.72 12.81,45.72 LEDG13.DO
N$37
  Top 0.406: LEDG03.DO 7.19,42.34 7.62,41.91 8.89,41.91 LEDG04.DI
N$38
  Top 0.406: LEDG14.DI 16.51,39.37 15.24,38.1 12.59,38.1 LEDG04.DO
N$39
  Top 0.406: LEDG24.DI 24.13,39.37 22.86,38.1 20.21,38.1 LEDG14.DO
N$40
  Top 0.406: LEDG34.DI 31.75,39.37 30.48,38.1 27.83,38.1 LEDG24.DO
N$41
  Top 0.406: LEDG44.DI 39.37,39.37 38.1,38.1 35.45,38.1 LEDG34.DO
N$42
  Top 0.406: LEDG54.DI 46.99,39.37 45.72,38.1 43.07,38.1 LEDG44.DO
N$43
  Top 0.406: LEDG64.DI 54.61,39.37 53.34,38.1 50.69,38.1 LEDG54.DO
N$44
  Top 0.406: LEDG74.DI 62.23,39.37 60.96,38.1 58.31,38.1 LEDG64.DO
N$45
  Top 0.406: LEDG84.DI 69.85,39.37 68.58,38.1 65.93,38.1 LEDG74.DO
N$46  (via drill 0.6)
  Top 0.406: LEDG84.DO 71.55,38.94 v72.39,38.1 | LEDG85.DI 69.85,29.21 v68.58,30.48
  Bottom 0.406: v72.39,38.1 72.39,34.29 v68.58,30.48
N$47
  Top 0.406: LEDG75.DI 62.23,29.21 63.5,30.48 66.15,30.48 LEDG85.DO
N$48
  Top 0.406: LEDG65.DI 54.61,29.21 55.88,30.48 58.53,30.48 LEDG75.DO
N$49
  Top 0.406: LEDG55.DI 46.99,29.21 48.26,30.48 50.91,30.48 LEDG65.DO
N$50
  Top 0.406: LEDG45.DI 39.37,29.21 40.64,30.48 43.29,30.48 LEDG55.DO
N$51
  Top 0.406: LEDG35.DI 31.75,29.21 33.02,30.48 35.67,30.48 LEDG45.DO
N$52
  Top 0.406: LEDG25.DI 24.13,29.21 25.4,30.48 28.05,30.48 LEDG35.DO
N$53
  Top 0.406: LEDG15.DI 16.51,29.21 17.78,30.48 20.43,30.48 LEDG25.DO
N$54
  Top 0.406: LEDG05.DI 8.89,29.21 10.16,30.48 12.81,30.48 LEDG15.DO
N$55
  Top 0.406: LEDG05.DO 7.19,27.1 7.62,26.67 8.89,26.67 LEDG06.DI
N$56
  Top 0.406: LEDG16.DI 16.51,24.13 15.24,22.86 12.59,22.86 LEDG06.DO
N$57
  Top 0.406: LEDG26.DI 24.13,24.13 22.86,22.86 20.21,22.86 LEDG16.DO
N$58
  Top 0.406: LEDG36.DI 31.75,24.13 30.48,22.86 27.83,22.86 LEDG26.DO
N$59
  Top 0.406: LEDG46.DI 39.37,24.13 38.1,22.86 35.45,22.86 LEDG36.DO
N$60
  Top 0.406: LEDG56.DI 46.99,24.13 45.72,22.86 43.07,22.86 LEDG46.DO
N$61
  Top 0.406: LEDG66.DI 54.61,24.13 53.34,22.86 50.69,22.86 LEDG56.DO
N$62
  Top 0.406: LEDG76.DI 62.23,24.13 60.96,22.86 58.31,22.86 LEDG66.DO
N$63
  Top 0.406: LEDG86.DI 69.85,24.13 68.58,22.86 65.93,22.86 LEDG76.DO
N$64  (via drill 0.6)
  Top 0.406: LEDG86.DO 71.55,23.7 v72.39,22.86 | LEDG87.DI 69.85,13.97 v68.58,15.24
  Bottom 0.406: v72.39,22.86 72.39,19.05 v68.58,15.24
N$65
  Top 0.406: LEDG77.DI 62.23,13.97 63.5,15.24 66.15,15.24 LEDG87.DO
N$66
  Top 0.406: LEDG67.DI 54.61,13.97 55.88,15.24 58.53,15.24 LEDG77.DO
N$67
  Top 0.406: LEDG57.DI 46.99,13.97 48.26,15.24 50.91,15.24 LEDG67.DO
N$68
  Top 0.406: LEDG47.DI 39.37,13.97 40.64,15.24 43.29,15.24 LEDG57.DO
N$69
  Top 0.406: LEDG37.DI 31.75,13.97 33.02,15.24 35.67,15.24 LEDG47.DO
N$70
  Top 0.406: LEDG27.DI 24.13,13.97 25.4,15.24 28.05,15.24 LEDG37.DO
N$71
  Top 0.406: LEDG17.DI 16.51,13.97 17.78,15.24 20.43,15.24 LEDG27.DO
N$72
  Top 0.406: LEDG07.DI 8.89,13.97 10.16,15.24 12.81,15.24 LEDG17.DO
N$73
  Top 0.406: LEDG07.DO 7.19,11.86 7.62,11.43 8.89,11.43 LEDG08.DI
N$74
  Top 0.406: LEDG18.DI 16.51,8.89 15.24,7.62 12.59,7.62 LEDG08.DO
N$75
  Top 0.406: LEDG28.DI 24.13,8.89 22.86,7.62 20.21,7.62 LEDG18.DO
N$76
  Top 0.406: LEDG38.DI 31.75,8.89 30.48,7.62 27.83,7.62 LEDG28.DO
N$77
  Top 0.406: LEDG48.DI 39.37,8.89 38.1,7.62 35.45,7.62 LEDG38.DO
N$78
  Top 0.406: LEDG58.DI 46.99,8.89 45.72,7.62 43.07,7.62 LEDG48.DO
N$79
  Top 0.406: LEDG68.DI 54.61,8.89 53.34,7.62 50.69,7.62 LEDG58.DO
N$80
  Top 0.406: LEDG78.DI 62.23,8.89 60.96,7.62 58.31,7.62 LEDG68.DO
N$81
  Top 0.406: LEDG88.DI 69.85,8.89 68.58,7.62 65.93,7.62 LEDG78.DO